# EAGLE design breakout (EAGLE 6.1)
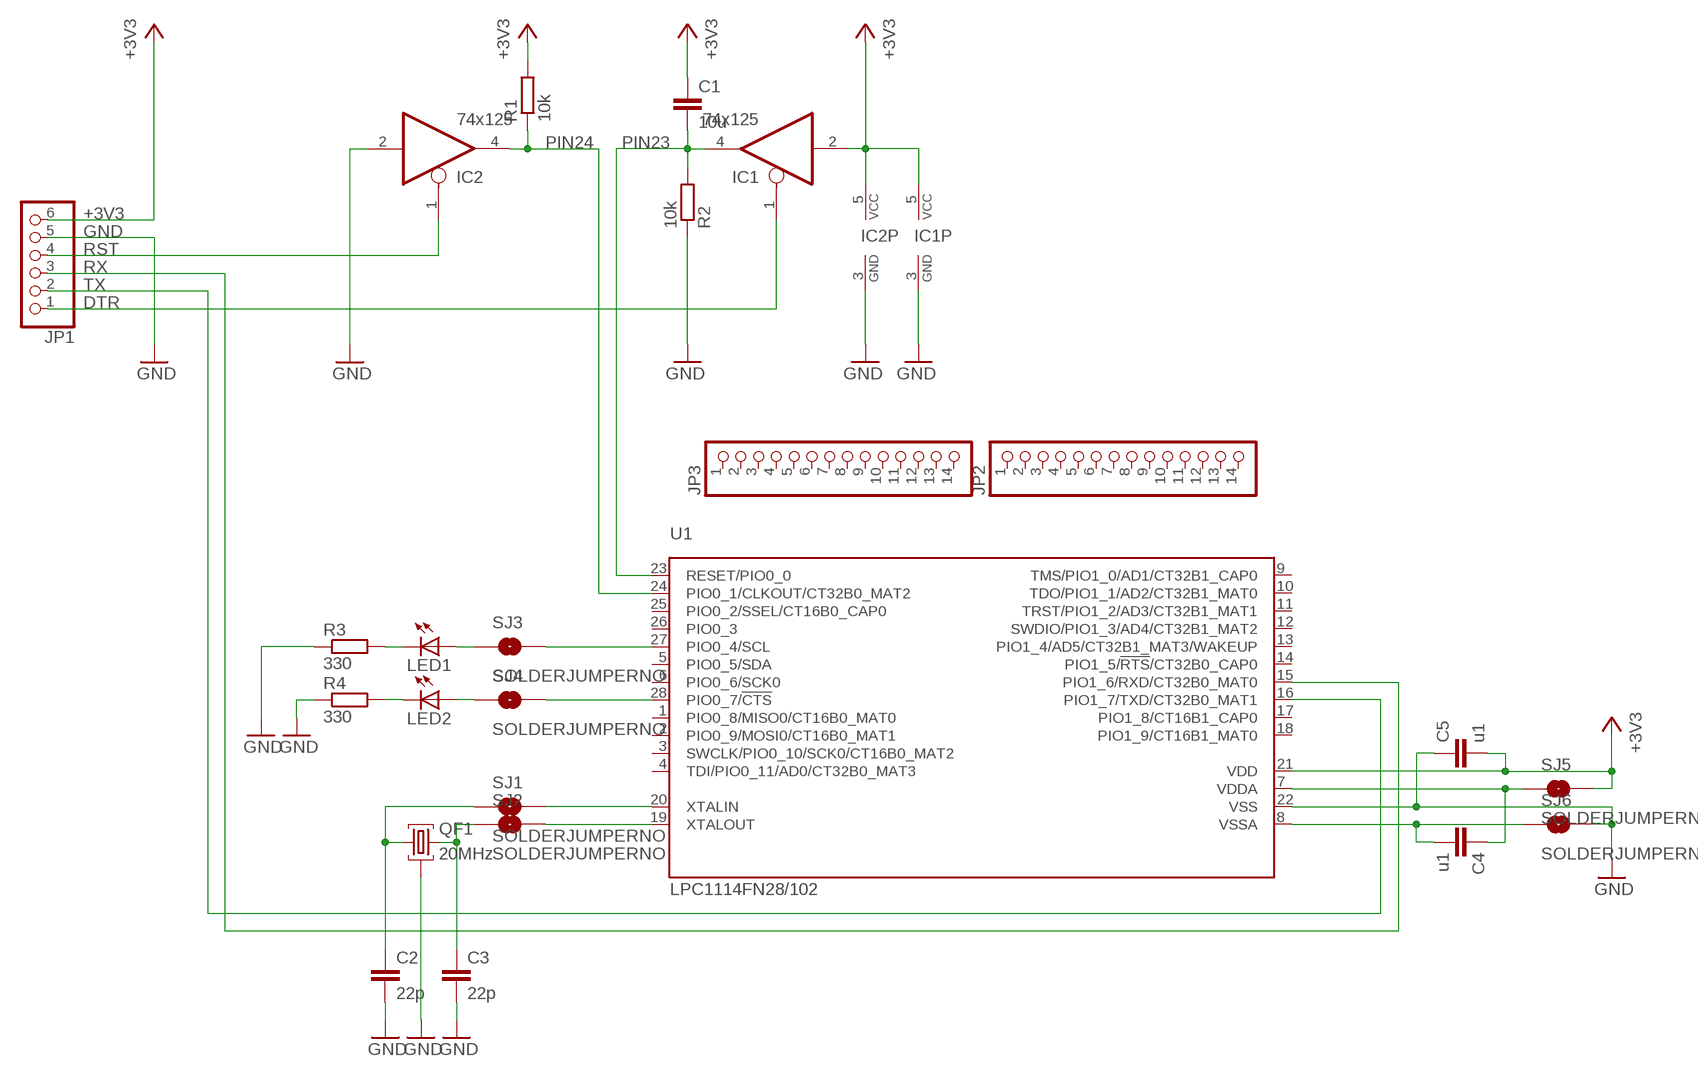
[diagram p0: schematic, sheet 1]

## Parts
C1  10u  C-EUC0805K  [C0805K]
C2  22p  C-EUC0805K  [C0805K]
C3  22p  C-EUC0805K  [C0805K]
C4  u1  C-EUC0805K  [C0805K]
C5  u1  C-EUC0805K  [C0805K]
IC1  74x125  74AHC1G125DBV  [SOT23-5]
IC2  74x125  74AHC1G125DBV  [SOT23-5]
JP1  PINHD-1X6/90  [1X06/90]
JP2  PINHD-1X14  [1X14]
JP3  PINHD-1X14  [1X14]
LED1  LEDLD260  [LD260]
LED2  LEDLD260  [LD260]
QF1  20MHz  10M7AHC49T  [HC49U]
R1  10k  R-EU_M0805  [M0805]
R2  10k  R-EU_M0805  [M0805]
R3  330  R-EU_M0805  [M0805]
R4  330  R-EU_M0805  [M0805]
SJ1  SOLDERJUMPERNO  [SJ_2S-NO]
SJ2  SOLDERJUMPERNO  [SJ_2S-NO]
SJ3  SOLDERJUMPERNO  [SJ_2S-NO]
SJ4  SOLDERJUMPERNO  [SJ_2S-NO]
SJ5  SOLDERJUMPERNO  [SJ_2S-NO]
SJ6  SOLDERJUMPERNO  [SJ_2S-NO]
U1  LPC1114FN28/102  [SOT117]

## Nets
+3V3: C1.1 C5.2 IC1.2(I) IC1.5(VCC) IC2.5(VCC) JP1.6 R1.2 SJ5.2 U1.21(VDD)
DTR: IC1.1(OE) JP1.1
GND: C2.2 C3.2 C5.1 IC1.3(GND) IC2.2(I) IC2.3(GND) JP1.5 QF1.2 R2.1 R3.1 R4.1 SJ6.2 U1.22(VSS)
N$1: LED2.A SJ4.1
N$2: LED1.A SJ3.1
N$3: LED1.K(C) R3.2
N$4: LED2.K(C) R4.2
N$5: SJ2.2 U1.19(XTALOUT)
N$6: SJ1.2 U1.20(XTALIN)
N$7: SJ4.2 U1.28(PIO0_7/!CTS!)
N$8: SJ3.2 U1.27(PIO0_4/SCL)
N$9: C3.1 QF1.3 SJ2.1
N$10: C2.1 QF1.1 SJ1.1
PIN7: C4.1 SJ5.1 U1.7(VDDA)
PIN8: C4.2 SJ6.1 U1.8(VSSA)
PIN23: C1.2 IC1.4(O) R2.2 U1.23(RESET/PIO0_0)
PIN24: IC2.4(O) R1.1 U1.24(PIO0_1/CLKOUT/CT32B0_MAT2)
RST: IC2.1(OE) JP1.4
RX: JP1.3 U1.15(PIO1_6/RXD/CT32B0_MAT0)
TX: JP1.2 U1.16(PIO1_7/TXD/CT32B0_MAT1)
Unconnected: JP2.1 JP2.2 JP2.3 JP2.4 JP2.5 JP2.6 JP2.7 JP2.8 JP2.9 JP2.10 JP2.11 JP2.12 JP2.13 JP2.14 JP3.1 JP3.2 JP3.3 JP3.4 JP3.5 JP3.6 JP3.7 JP3.8 JP3.9 JP3.10 JP3.11 JP3.12 JP3.13 JP3.14 U1.1(PIO0_8/MISO0/CT16B0_MAT0) U1.2(PIO0_9/MOSI0/CT16B0_MAT1) U1.3(SWCLK/PIO0_10/SCK0/CT16B0_MAT2) U1.4(TDI/PIO0_11/AD0/CT32B0_MAT3) U1.5(PIO0_5/SDA) U1.6(PIO0_6/SCK0) U1.9(TMS/PIO1_0/AD1/CT32B1_CAP0) U1.10(TDO/PIO1_1/AD2/CT32B1_MAT0) U1.11(TRST/PIO1_2/AD3/CT32B1_MAT1) U1.12(SWDIO/PIO1_3/AD4/CT32B1_MAT2) U1.13(PIO1_4/AD5/CT32B1_MAT3/WAKEUP) U1.14(PIO1_5/!RTS!/CT32B0_CAP0) U1.17(PIO1_8/CT16B1_CAP0) U1.18(PIO1_9/CT16B1_MAT0) U1.25(PIO0_2/SSEL/CT16B0_CAP0) U1.26(PIO0_3)

## Library data of the parts
C1-C5 = rcl:C-EU: CAPACITOR, European symbol
IC1 IC2 = 74xx-little-us:74*1G125: Single Bus Buffer Gate with 3-State Output
JP1 = pinhead:PINHD-1X6: PIN HEADER
JP2 JP3 = pinhead:PINHD-1X14: PIN HEADER
LED1 LED2 = led:LED: LED OSRAM: - CHIPLED LG R971, LG N971, LY N971, LG Q971, LY Q971, LO R971, LY R971 LH N974, LH R974 LS Q976, LO Q976, LY Q976 LO Q996 - Hyper CHIPLED LW Q18S LB Q993, LB Q99A, LB R99A - SideLED LS A670, LO A670, LY A670, LG A670, LP A670 LB A673, LV A673, LT A673, LW A673 LH A674 LY A675 LS A676, LA A676, LO A676, LY A676, LW A676 LS A679, LY A679, LG A679 - Hyper Micro SIDELED® LS Y876, LA Y876, LO Y876, LY Y876 LT Y87S - SmartLED LW L88C, LW L88S LB L89C, LB L89S, LG L890 LS L89K, LO L89K, LY L89K LS L896, LA L896, LO L896, LY L896 - TOPLED LS T670, LO T670, LY T670, LG T670, LP T670 LSG T670, LSP T670, LSY T670, LOP T670, LYG T670 LG T671, LOG T671, LSG T671 LB T673, LV T673, LT T673, LW T673 LH T674 LS T676, LA T676, LO T676, LY T676, LB T676, LH T676, LSB T676, LW T676 LB T67C, LV T67C, LT T67C, LS T67K, LO T67K, LY T67K, LW E67C LS E67B, LA E67B, LO E67B, LY E67B, LB E67C, LV E67C, LT E67C LW T67C LS T679, LY T679, LG T679 LS T770, LO T770, LY T770, LG T770, LP T770 LB T773, LV T773, LT T773, LW T773 LH T774 LS E675, LA E675, LY E675, LS T675 LS T776, LA T776, LO T776, LY T776, LB T776 LHGB T686 LT T68C, LB T68C - Hyper Mini TOPLED® LB M676 - Mini TOPLED Santana® LG M470 LS M47K, LO M47K, LY M47K Source: http://www.osram.convergy.de LUXEON: - LUMILED® LXK2-PW12-R00, LXK2-PW12-S00, LXK2-PW14-U00, LXK2-PW14-V00 LXK2-PM12-R00, LXK2-PM12-S00, LXK2-PM14-U00 LXK2-PE12-Q00, LXK2-PE12-R00, LXK2-PE12-S00, LXK2-PE14-T00, LXK2-PE14-U00 LXK2-PB12-K00, LXK2-PB12-L00, LXK2-PB12-M00, LXK2-PB14-N00, LXK2-PB14-P00, LXK2-PB14-Q00 LXK2-PR12-L00, LXK2-PR12-M00, LXK2-PR14-Q00, LXK2-PR14-R00 LXK2-PD12-Q00, LXK2-PD12-R00, LXK2-PD12-S00 LXK2-PH12-R00, LXK2-PH12-S00 LXK2-PL12-P00, LXK2-PL12-Q00, LXK2-PL12-R00 Source: www.luxeon.com KINGBRIGHT: KA-3528ASYC Source: www.kingbright.com
QF1 = crystal:10M*A: Monolithic Crystal Filters Source: www.vanlong.com; OC_FARNELL: unknown; OC_NEWARK: unknown
R1-R4 = rcl:R-EU_: RESISTOR, European symbol
SJ1-SJ6 = SparkFun-Passives:SOLDERJUMPER: Solder Jumper Standard SMD solder jumper. Used to automate production. Two varients : Normally Open and Normally Closed are the same, but have different paste layers. NC will have a large amount of paste and should jumper during reflow.
U1 = _MY_OWN_LIB:LPC1114FN28: 32-bit ARM Cortex-M0 microcontroller; up to 64 kB flash and 8 kB SRAM The LPC1110/11/12/13/14/15 are a ARM Cortex-M0 based, low-cost 32-bit MCU family, designed for 8/16-bit microcontroller applications, offering performance, low power, simple instruction set and memory addressing together with reduced code size compared to existing 8/16-bit architectures. The LPC1110/11/12/13/14/15 operate at CPU frequencies of up to 50 MHz. The peripheral complement of the LPC1110/11/12/13/14/15 includes up to 64 kB of flash memory, up to 8 kB of data memory, one Fast-mode Plus I 2 C-bus interface, one RS-485/EIA-485 UART, up to two SPI interfaces with SSP features, four general purpose counter/timers, a 10-bit ADC, and up to 42 general purpose I/O pins. Remark: The LPC111x series consists of the LPC1100 series (parts LPC111x/101/201/301), LPC1100L series (parts LPC111x/002/102/202/302), and the LPC1100XL series (parts LPC111x/103/203/303/323/333). The LPC1100L and LPC1100XL series include the power profiles, a windowed watchdog timer, and a configurable open-drain mode. AAL Eindhoven MK; ADC: 6; FLASH: 32kB; GPIO: 22; PWR_PROFILES: yes; SERIES: LPC1100L; SPI: 1; SRAM: 4kB

## Board
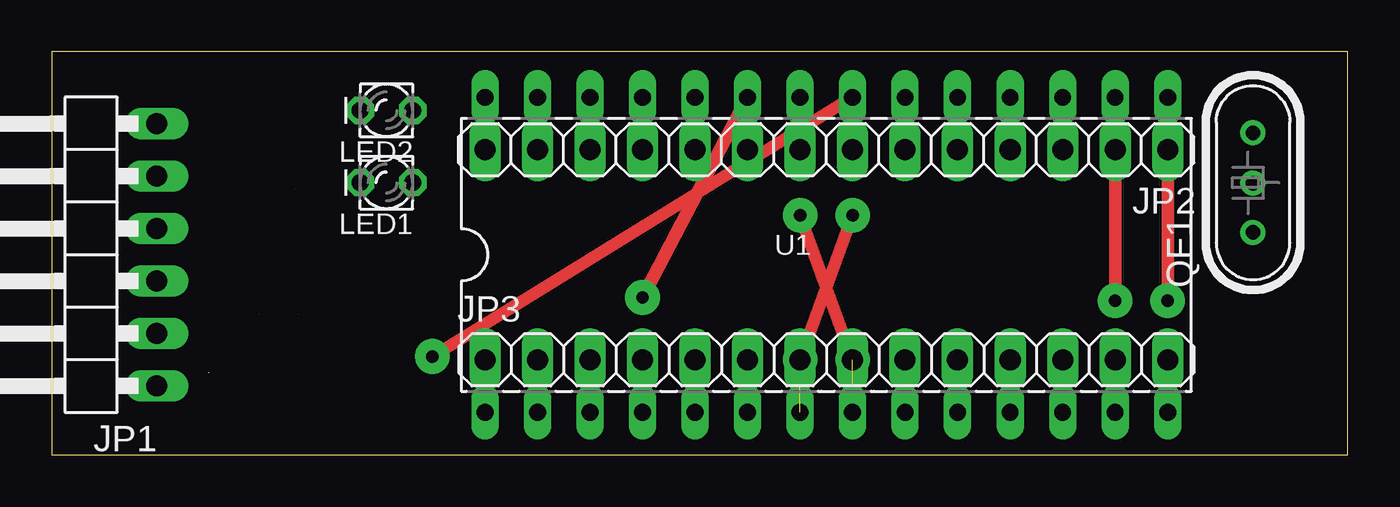
[diagram p1: board, top side]
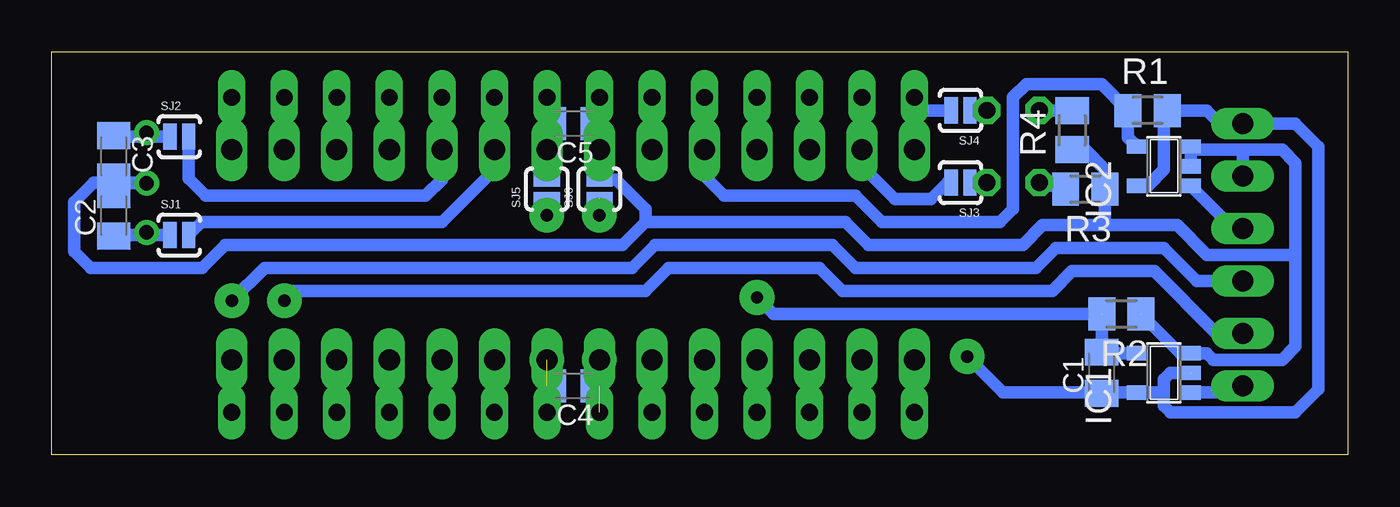
[diagram p2: board, bottom side, seen from below]

Size 62.69 x 19.51 mm. Coordinates in mm from the lower left corner, seen from the top.
Outline: 0,0 62.69,0 62.69,19.51 0,19.51 0,0
Copper layers (1*16): Top 0.035mm / dielectric 1.5mm / Bottom 0.035mm
Design rules: minimum track width 10mil, minimum drill 24mil, track to track 8mil, track to pad 8mil, pad to pad 8mil, via to via 8mil, smd to smd 8mil, copper to edge 40mil, drill to drill 8mil, minimum pad ring 10mil, minimum via ring 8mil, stop-mask expansion 4mil, vias tented up to drill 0mil, thermal gap 10mil

### Footprints (pad centres in the part's own frame; a part is rotated, then mirrored left to right if it is on the bottom)
C0805K = smd 1.3 x 1.6: 1 -1,0; 2 1,0
SOT23-5 = smd 0.69 x 0.99: 1 -0.95,-1.29; 2 0,-1.29; 3 0.95,-1.29; 4 0.95,1.3; 5 -0.95,1.3
1X06/90 = drill 1.016 long: 1 -6.35,-3.81; 2 -3.81,-3.81; 3 -1.27,-3.81; 4 1.27,-3.81; 5 3.81,-3.81; 6 6.35,-3.81
1X14 = drill 1.016 long: 1 -16.51,0; 2 -13.97,0; 3 -11.43,0; 4 -8.89,0; 5 -6.35,0; 6 -3.81,0; 7 -1.27,0; 8 1.27,0; 9 3.81,0; 10 6.35,0; 11 8.89,0; 12 11.43,0; 13 13.97,0; 14 16.51,0
LD260 = drill 0.813 octagon: A -1.27,0; K 1.27,0
HC49U = drill 0.7 pad 1.2: 1 -2.413,0; 2 -0.027,0; 3 2.413,0
M0805 = smd 1.3 x 1.6: 1 -0.95,0; 2 0.95,0
SJ_2S-NO = smd 0.635 x 1.27: 1 -0.45,0; 2 0.45,0
SOT117 = drill 0.813 long: 1 -16.51,-7.62; 2 -13.97,-7.62; 3 -11.43,-7.62; 4 -8.89,-7.62; 5 -6.35,-7.62; 6 -3.81,-7.62; 7 -1.27,-7.62; 8 1.27,-7.62; 9 3.81,-7.62; 10 6.35,-7.62; 11 8.89,-7.62; 12 11.43,-7.62; 13 13.97,-7.62; 14 16.51,-7.62; 15 16.51,7.62; 16 13.97,7.62; 17 11.43,7.62; 18 8.89,7.62; 19 6.35,7.62; 20 3.81,7.62; 21 1.27,7.62; 22 -1.27,7.62; 23 -3.81,7.62; 24 -6.35,7.62; 25 -8.89,7.62; 26 -11.43,7.62; 27 -13.97,7.62; 28 -16.51,7.62

### Placement (x,y rotation side)
C1  11.91,3.97 90 bottom
C2  59.69,11.59 90 bottom
C3  59.69,14.45 270 bottom
C4  37.47,3.33 180 bottom
C5  37.47,16.03 180 bottom
IC1  8.89,3.97 90 bottom
IC2  8.89,13.97 90 bottom
JP1  1.27,9.68 90 top
JP2  37.47,14.76 180 top
JP3  37.47,4.6 0 top
LED1  16.19,13.18 180 top
LED2  16.19,16.67 180 top
QF1  58.1,13.18 90 top
R1  9.68,16.67 0 bottom
R2  10.95,6.83 180 bottom
R3  12.7,12.86 180 bottom
R4  13.34,15.72 90 bottom
SJ1  56.52,10.64 0 bottom
SJ2  56.52,15.4 0 bottom
SJ3  18.73,13.18 180 bottom
SJ4  18.73,16.67 180 bottom
SJ5  38.73,12.86 90 bottom
SJ6  36.2,12.86 90 bottom
U1  37.47,9.68 0 top

### Tracks (layer width: path | path; a pad name or v marks a point on that pad's centre or on a via)
+3V3  (via drill 0.6 pad 1.68)  (1 unrouted)
  Top 0.61: v18.41,4.76 U1.21
  Bottom 0.61: 38.73,16.03 C5.2 38.47,17.3 U1.21 SJ5.2 | v18.41,4.76 16.67,3.02 11.59,3.02 | IC2.5 9.68,13.02 8.89,13.81 8.89,16.51 R1.2 6.83,16.67 6.19,16.03 JP1.6 2.54,16.03 1.43,14.92 1.43,3.17 2.54,2.06 8.57,2.06 8.89,2.38 8.89,2.86 | 8.89,2.86 8.89,3.65 8.57,3.97 7.62,3.97 | 8.89,2.86 9.05,3.02 IC1.5 11.59,3.02 | C1.1 11.64,2.97 11.59,3.02
DTR
  Bottom 0.61: JP1.1 5.38,3.02 IC1.1
GND  (2 unrouted)
  Bottom 0.61: 11.43,12.54 R3.1 | R4.1 13.65,14.76 12.7,14.76 11.75,13.81 R3.1 11.75,11.12 11.75,11.11 | 59.37,13.18 60.64,13.18 61.59,12.22 61.59,9.84 60.8,9.05 55.4,9.05 54.29,10.16 35.08,10.16 33.97,11.27 | 59.37,13.18 58.1,13.18 | QF1.2 59.39,13.15 | 59.39,13.15 C3.2 | 59.39,13.15 59.39,13.16 59.37,13.18 | 59.39,13.15 59.39,12.89 C2.2 | 33.97,11.27 24.29,11.27 23.18,10.16 15.72,10.16 14.76,11.11 11.75,11.11 | 36.2,16.03 C5.1 36.47,17.3 U1.22 SJ6.2 36.17,13.34 35.4,13.34 33.97,11.91 33.97,11.27 | 5.08,14.76 7.44,14.76 IC2.3 IC2.2 | 5.08,14.76 3.17,14.76 2.54,14.13 2.54,9.68 | JP1.5 5.08,14.76 | 11.75,11.11 8.26,11.11 6.83,9.68 2.54,9.68 | 2.54,9.68 2.54,5.24 3.17,4.6 6.51,4.6 6.83,4.92 IC1.3 8.09,4.92 R2.1
N$1
  Bottom 0.61: LED2.A SJ4.1
N$2
  Bottom 0.61: LED1.A SJ3.1
N$3
  Bottom 0.61: R3.2 LED1.K
N$4
  Bottom 0.61: R4.2 13.65,16.67 LED2.K
N$5
  Bottom 0.61: U1.19 43.81,13.34 44.61,12.54 55.24,12.54 56.06,13.36 SJ2.2
N$6
  Bottom 0.61: U1.20 41.27,13.81 43.81,11.27 55.43,11.27 SJ1.2
N$7
  Bottom 0.61: SJ4.2 20.95,16.67 U1.28
N$8
  Bottom 0.61: SJ3.2 19.37,13.18 20.16,12.38 21.91,12.38 23.5,13.97 U1.27
N$9
  Bottom 0.61: SJ2.1 57.78,15.4 | 57.78,15.4 59.64,15.4 C3.1 | QF1.3 57.98,15.59 57.78,15.4
N$10
  Bottom 0.61: SJ1.1 57.78,10.64 | 57.78,10.64 59.64,10.64 C2.1 | QF1.1 57.91,10.76 57.78,10.64
PIN7  (via drill 0.6 pad 1.68)  (1 unrouted)
  Top 0.61: v36.2,4.6 v38.73,11.59
  Bottom 0.61: 36.2,3.33 C4.1 v36.2,4.6 | SJ5.1 v38.73,11.59
PIN8  (via drill 0.6 pad 1.68)  (2 unrouted)
  Top 0.61: v38.73,4.6 v36.2,11.59
  Bottom 0.61: C4.2 38.73,3.33 | 36.2,12.38 v36.2,11.59 | U1.8 v38.73,4.6
PIN23  (via drill 0.6 pad 1.68)  (1 unrouted)
  Top 0.61: v28.57,7.62 U1.23
  Bottom 0.61: IC1.4 11.86,4.92 C1.2 R2.2 | R2.2 27.78,6.83 v28.57,7.62
PIN24
  Bottom 0.61: U1.24 31.11,13.49 30.16,12.54 23.81,12.54 22.54,11.27 16.83,11.27 16.19,11.91 16.19,17.3 15.56,17.94 11.9,17.94 R1.1 10.63,15.36 IC2.4
RST
  Bottom 0.61: JP1.4 5.53,10.95 IC2.1
RX  (via drill 0.6 pad 1.68)
  Top 0.61: v53.98,7.46 U1.15
  Bottom 0.61: JP1.3 7.3,8.41 8.89,10 14.13,10 15.08,9.05 23.81,9.05 24.92,10.16 33.5,10.16 34.61,9.05 52.39,9.05 v53.98,7.46
TX  (via drill 0.6 pad 1.68)
  Top 0.61: v51.44,7.46 U1.16
  Bottom 0.61: JP1.2 6.35,5.87 9.37,8.89 13.34,8.89 14.29,7.94 24.45,7.94 25.56,9.05 32.86,9.05 33.97,7.94 50.96,7.94 v51.44,7.46